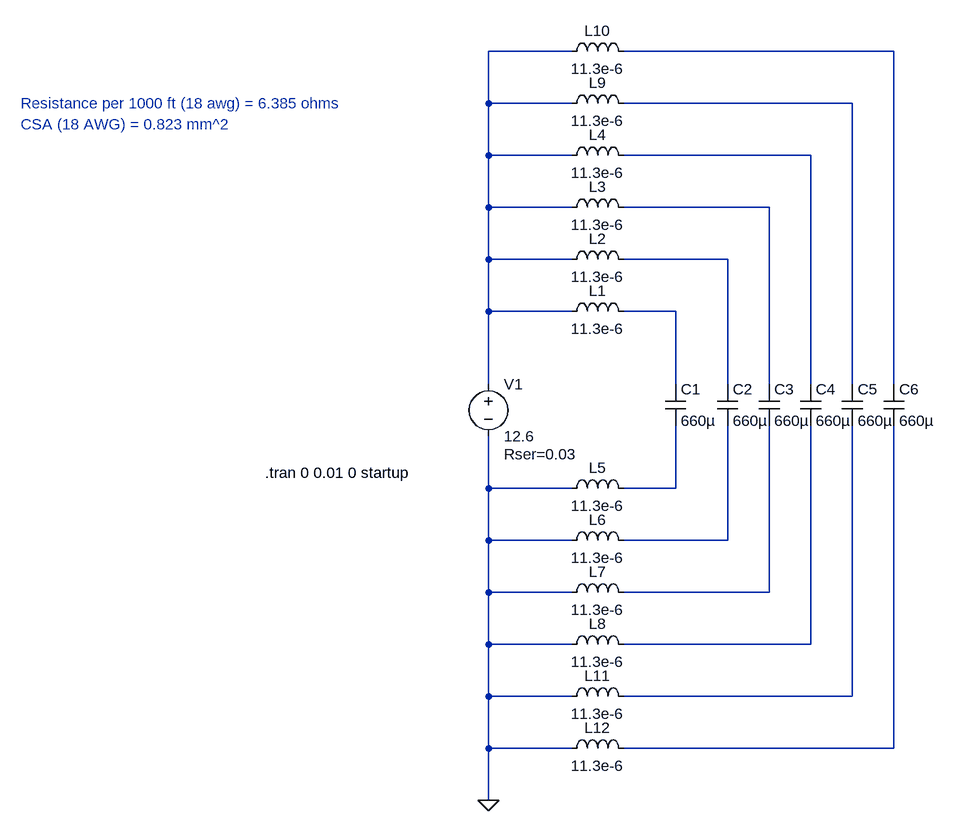
[diagram p0: schematic esc_inrush.asc]
esc_inrush.asc, the LTspice schematic file:
Version 4
SHEET 1 880 788
WIRE 176 -384 48 -384
WIRE 672 -384 256 -384
WIRE 48 -304 48 -384
WIRE 176 -304 48 -304
WIRE 608 -304 256 -304
WIRE 48 -224 48 -304
WIRE 176 -224 48 -224
WIRE 544 -224 256 -224
WIRE 48 -144 48 -224
WIRE 176 -144 48 -144
WIRE 480 -144 256 -144
WIRE 48 -64 48 -144
WIRE 176 -64 48 -64
WIRE 416 -64 256 -64
WIRE 48 16 48 -64
WIRE 176 16 48 16
WIRE 336 16 256 16
WIRE 48 128 48 16
WIRE 336 128 336 16
WIRE 416 128 416 -64
WIRE 480 128 480 -144
WIRE 544 128 544 -224
WIRE 608 128 608 -304
WIRE 672 128 672 -384
WIRE 48 288 48 208
WIRE 176 288 48 288
WIRE 336 288 336 192
WIRE 336 288 256 288
WIRE 48 368 48 288
WIRE 176 368 48 368
WIRE 416 368 416 192
WIRE 416 368 256 368
WIRE 48 448 48 368
WIRE 176 448 48 448
WIRE 480 448 480 192
WIRE 480 448 256 448
WIRE 48 528 48 448
WIRE 176 528 48 528
WIRE 544 528 544 192
WIRE 544 528 256 528
WIRE 48 608 48 528
WIRE 176 608 48 608
WIRE 608 608 608 192
WIRE 608 608 256 608
WIRE 48 688 48 608
WIRE 176 688 48 688
WIRE 672 688 672 192
WIRE 672 688 256 688
WIRE 48 768 48 688
FLAG 48 768 0
SYMBOL voltage 48 112 R0
WINDOW 123 0 0 Left 0
WINDOW 39 24 124 Left 2
SYMATTR InstName V1
SYMATTR Value 12.6
SYMATTR SpiceLine Rser=0.03
SYMBOL cap 320 128 R0
SYMATTR InstName C1
SYMATTR Value 660µ
SYMATTR SpiceLine Rser=0.0066
SYMBOL ind 160 32 R270
WINDOW 0 32 56 VTop 2
WINDOW 3 5 56 VBottom 2
SYMATTR InstName L1
SYMATTR Value 11.3e-6
SYMATTR SpiceLine Rser=0.01277
SYMBOL cap 400 128 R0
SYMATTR InstName C2
SYMATTR Value 660µ
SYMATTR SpiceLine Rser=0.0066
SYMBOL cap 464 128 R0
SYMATTR InstName C3
SYMATTR Value 660µ
SYMATTR SpiceLine Rser=0.0066
SYMBOL cap 528 128 R0
SYMATTR InstName C4
SYMATTR Value 660µ
SYMATTR SpiceLine Rser=0.0066
SYMBOL ind 160 -48 R270
WINDOW 0 32 56 VTop 2
WINDOW 3 5 56 VBottom 2
SYMATTR InstName L2
SYMATTR Value 11.3e-6
SYMATTR SpiceLine Rser=0.01277
SYMBOL ind 160 -128 R270
WINDOW 0 32 56 VTop 2
WINDOW 3 5 56 VBottom 2
SYMATTR InstName L3
SYMATTR Value 11.3e-6
SYMATTR SpiceLine Rser=0.01277
SYMBOL ind 160 -208 R270
WINDOW 0 32 56 VTop 2
WINDOW 3 5 56 VBottom 2
SYMATTR InstName L4
SYMATTR Value 11.3e-6
SYMATTR SpiceLine Rser=0.01277
SYMBOL ind 160 304 R270
WINDOW 0 32 56 VTop 2
WINDOW 3 5 56 VBottom 2
SYMATTR InstName L5
SYMATTR Value 11.3e-6
SYMATTR SpiceLine Rser=0.01277
SYMBOL ind 160 384 R270
WINDOW 0 32 56 VTop 2
WINDOW 3 5 56 VBottom 2
SYMATTR InstName L6
SYMATTR Value 11.3e-6
SYMATTR SpiceLine Rser=0.01277
SYMBOL ind 160 464 R270
WINDOW 0 32 56 VTop 2
WINDOW 3 5 56 VBottom 2
SYMATTR InstName L7
SYMATTR Value 11.3e-6
SYMATTR SpiceLine Rser=0.01277
SYMBOL ind 160 544 R270
WINDOW 0 32 56 VTop 2
WINDOW 3 5 56 VBottom 2
SYMATTR InstName L8
SYMATTR Value 11.3e-6
SYMATTR SpiceLine Rser=0.01277
SYMBOL cap 592 128 R0
SYMATTR InstName C5
SYMATTR Value 660µ
SYMATTR SpiceLine Rser=0.0066
SYMBOL cap 656 128 R0
SYMATTR InstName C6
SYMATTR Value 660µ
SYMATTR SpiceLine Rser=0.0066
SYMBOL ind 160 -288 R270
WINDOW 0 32 56 VTop 2
WINDOW 3 5 56 VBottom 2
SYMATTR InstName L9
SYMATTR Value 11.3e-6
SYMATTR SpiceLine Rser=0.01277
SYMBOL ind 160 -368 R270
WINDOW 0 32 56 VTop 2
WINDOW 3 5 56 VBottom 2
SYMATTR InstName L10
SYMATTR Value 11.3e-6
SYMATTR SpiceLine Rser=0.01277
SYMBOL ind 160 624 R270
WINDOW 0 32 56 VTop 2
WINDOW 3 5 56 VBottom 2
SYMATTR InstName L11
SYMATTR Value 11.3e-6
SYMATTR SpiceLine Rser=0.01277
SYMBOL ind 160 704 R270
WINDOW 0 32 56 VTop 2
WINDOW 3 5 56 VBottom 2
SYMATTR InstName L12
SYMATTR Value 11.3e-6
SYMATTR SpiceLine Rser=0.01277
TEXT -672 -304 Left 2 ;Resistance per 1000 ft (18 awg) = 6.385 ohms
TEXT -672 -272 Left 2 ;CSA (18 AWG) = 0.823 mm^2
TEXT -296 264 Left 2 !.tran 0 0.01 0 startup

The netlist it stands for:
* esc_inrush.asc
V1 N001 0 12.6 Rser=0.03
C1 N007 N008 660µ Rser=0.0066
L1 N001 N007 11.3e-6 Rser=0.01277
C2 N006 N009 660µ Rser=0.0066
C3 N005 N010 660µ Rser=0.0066
C4 N004 N011 660µ Rser=0.0066
L2 N001 N006 11.3e-6 Rser=0.01277
L3 N001 N005 11.3e-6 Rser=0.01277
L4 N001 N004 11.3e-6 Rser=0.01277
L5 0 N008 11.3e-6 Rser=0.01277
L6 0 N009 11.3e-6 Rser=0.01277
L7 0 N010 11.3e-6 Rser=0.01277
L8 0 N011 11.3e-6 Rser=0.01277
C5 N003 N012 660µ Rser=0.0066
C6 N002 N013 660µ Rser=0.0066
L9 N001 N003 11.3e-6 Rser=0.01277
L10 N001 N002 11.3e-6 Rser=0.01277
L11 0 N012 11.3e-6 Rser=0.01277
L12 0 N013 11.3e-6 Rser=0.01277
* Resistance per 1000 ft (18 awg) = 6.385 ohms
* CSA (18 AWG) = 0.823 mm^2
.tran 0 0.01 0 startup
.backanno
.end